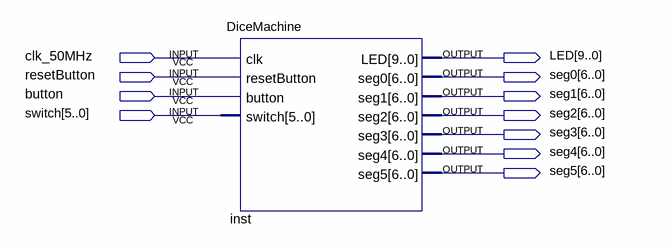
[diagram p0: schematic sheet]
// Quartus schematic ECE_272_Design_Project.bdf as structural Verilog: 1 symbols, 11 pins
module ECE_272_Design_Project (
  input  clk_50MHz,
  input  resetButton,
  input  button,
  input  [5:0] switch,
  output [9:0] LED,
  output [6:0] seg0,
  output [6:0] seg1,
  output [6:0] seg2,
  output [6:0] seg3,
  output [6:0] seg4,
  output [6:0] seg5
);

  DiceMachine inst (
    .clk(clk_50MHz), .resetButton(resetButton), .button(button), .switch(switch), .LED(LED), .seg0(seg0),
    .seg1(seg1), .seg2(seg2), .seg3(seg3), .seg4(seg4), .seg5(seg5));
endmodule
